# EAGLE design CDCEmu_Logic_v2.1 (EAGLE 9.6.2)
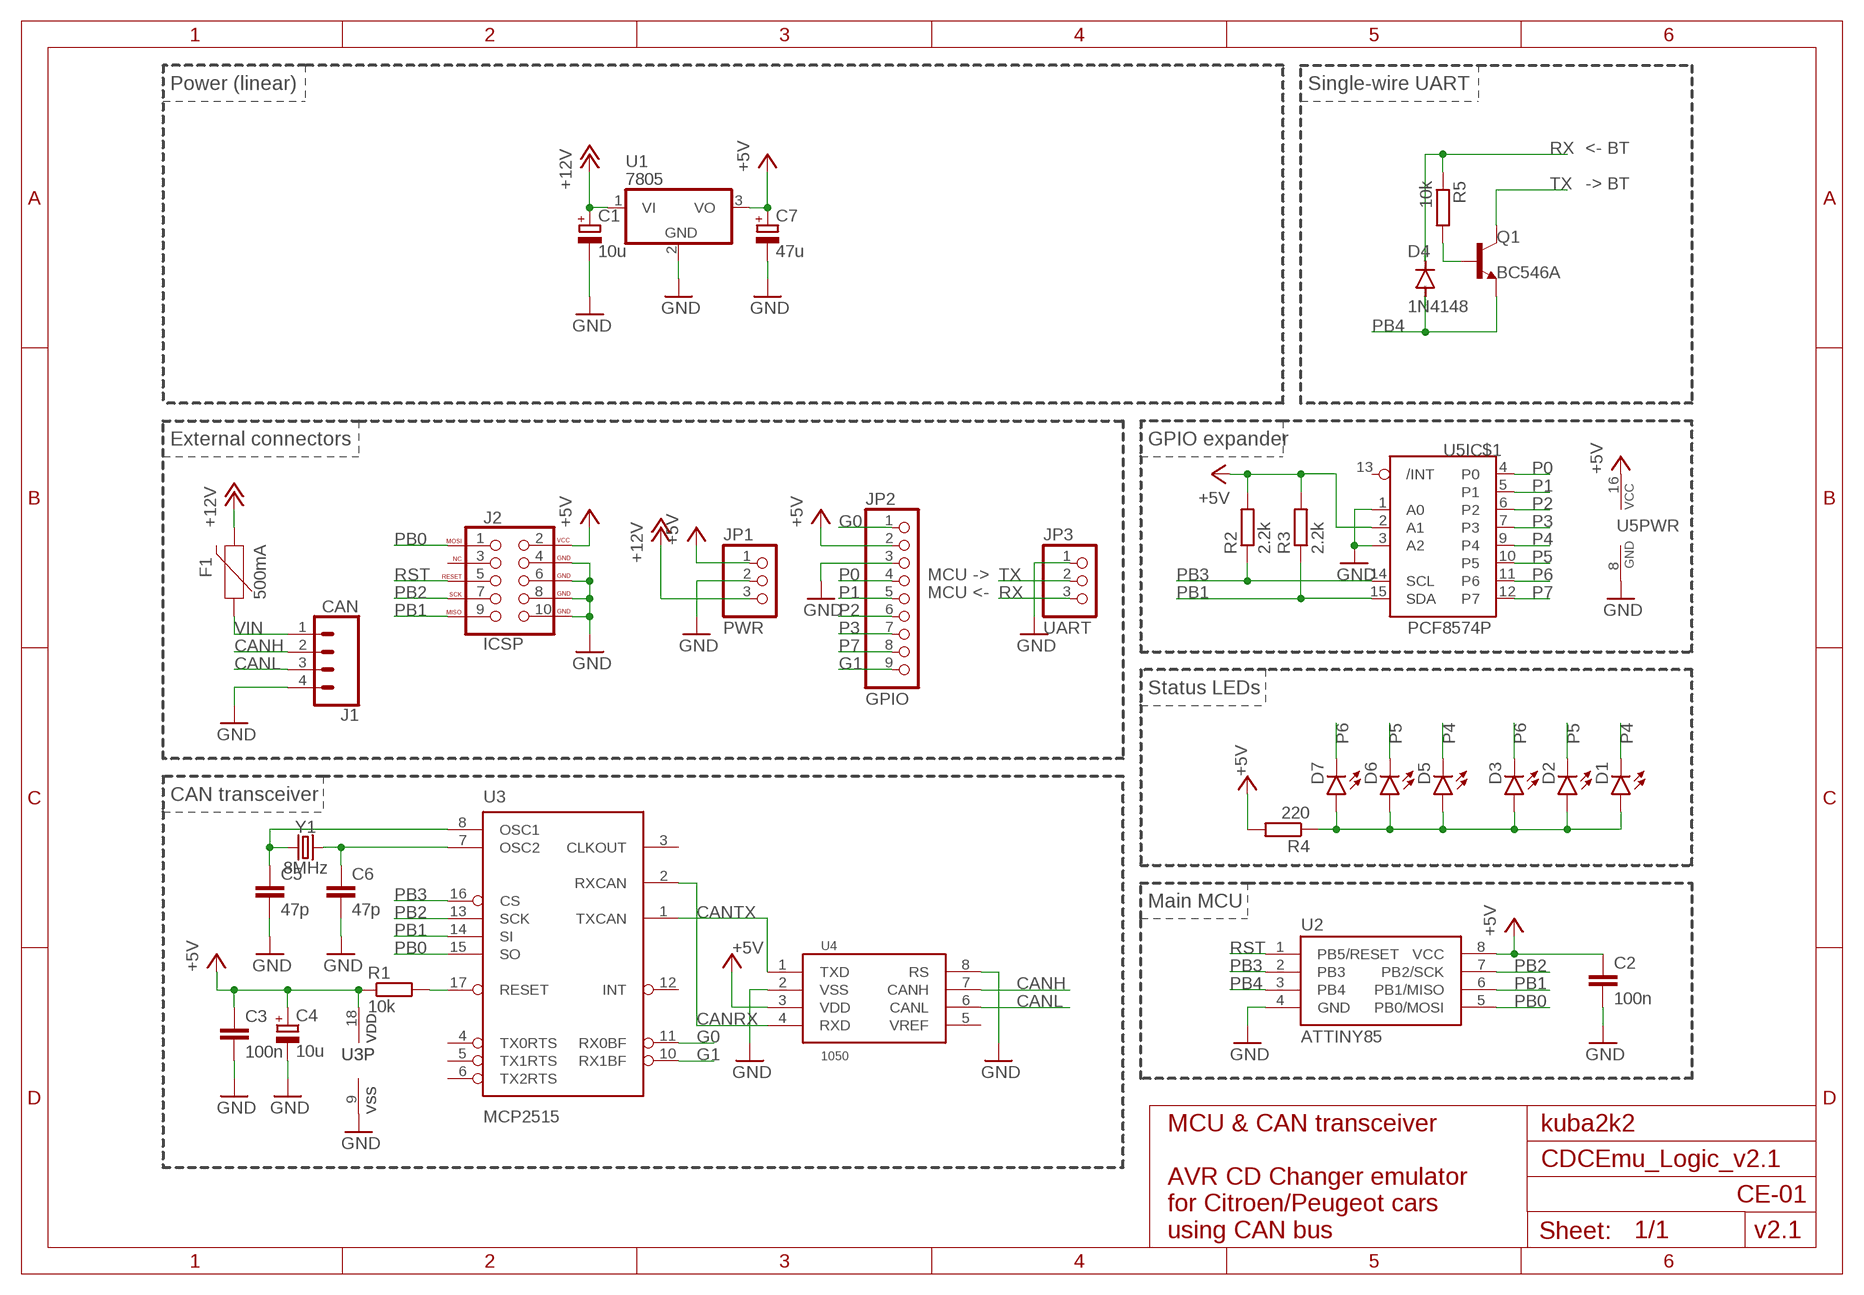
[diagram p0: schematic, sheet 1]

## Parts
C1  10u  CPOL-EUC2512  [C2512-POL]
C2  100n  C-EU050-024X044  [C050-024X044]
C3  100n  C-EU050-024X044  [C050-024X044]
C4  10u  CPOL-EUE2.5-6  [E2,5-6]
C5  47p  C-EUC0805  [C0805]
C6  47p  C-EUC0805  [C0805]
C7  47u  CPOL-EUC2512  [C2512-POL]
D1  LED3MM  [LED3MM]
D2  LED3MM  [LED3MM]
D3  LED3MM  [LED3MM]
D4  1N4148  1N4148DO35-7  [DO35-7]
D5  LEDCHIP-LED0805  [CHIP-LED0805]
D6  LEDCHIP-LED0805  [CHIP-LED0805]
D7  LEDCHIP-LED0805  [CHIP-LED0805]
F1  500mA  PPTC_16V_2.5A  [1812]
J1  CAN  CONN_04JST-PTH  [JST-4-PTH]
J2  ICSP  AVR_SPI_PROG_5X2LOCK  [2X5-SHROUDED_LOCK]
JP1  PWR  PINHD-1X3  [1X03]
JP2  GPIO  PINHD-1X9  [1X09]
JP3  UART  PINHD-1X3  [1X03]
Q1  BC546A  [TO92-EBC]
R1  10k  R-EU_R0805  [R0805]
R2  2.2k  R-EU_R0805  [R0805]
R3  2.2k  R-EU_R0805  [R0805]
R4  220  R-EU_0204/7  [0204/7]
R5  10k  R-EU_0204/7  [0204/7]
U1  7805  78T-NOHOLE  [TO220H-NOHOLE]
U2  ATTINY85  ATTINY85-P  [PDIP08_300MIL]
U3  MCP2515  MCP2515(MCP2510)SO  [SO18W]
U4  1050  TJA1050  [SO08]
U5  PCF8574P  [DIL16]
Y1  8MHz  CRYSTALPTH-HC49UV  [HC49U]

## Nets
+5V: C2.1 C3.1 C4.+ C7.+ J2.2(VCC) JP1.1 JP2.2 R1.1 R2.2 R3.2 R4.2 U1.3(VO) U2.8(VCC) U3.18(VDD) U4.3(VDD) U5.2(IC$1:A1) U5.16(PWR:VCC)
+12V: C1.+ F1.2 JP1.3 U1.1(VI)
CANH: J1.2 U4.7(CANH)
CANL: J1.3 U4.6(CANL)
CANOSC1: C5.1 U3.8(OSC1) Y1.1
CANOSC2: C6.1 U3.7(OSC2) Y1.2
CANRST: R1.2 U3.17(RESET)
CANRX: U3.2(RXCAN) U4.4(RXD)
CANTX: U3.1(TXCAN) U4.1(TXD)
G0: JP2.1 U3.11(RX0BF)
G1: JP2.9 U3.10(RX1BF)
GND: C1.- C2.2 C3.2 C4.- C5.2 C6.2 C7.- J1.4 J2.4(GND) J2.6(GND) J2.8(GND) J2.10(GND) JP1.2 JP2.3 JP3.1 U1.2(GND) U2.4(GND) U3.9(VSS) U4.2(VSS) U4.8(RS) U5.1(IC$1:A0) U5.3(IC$1:A2) U5.8(PWR:GND)
LED_A: D1.A D2.A D3.A D5.A D6.A D7.A R4.1
P0: JP2.4 U5.4(IC$1:P0)
P1: JP2.5 U5.5(IC$1:P1)
P2: JP2.6 U5.6(IC$1:P2)
P3: JP2.7 U5.7(IC$1:P3)
P4: D1.K(C) D5.C U5.9(IC$1:P4)
P5: D2.K(C) D6.C U5.10(IC$1:P5)
P6: D3.K(C) D7.C U5.11(IC$1:P6)
P7: JP2.8 U5.12(IC$1:P7)
PB0: J2.1(MOSI) U2.5(PB0/MOSI) U3.15(SO)
PB1: J2.9(MISO) R3.1 U2.6(PB1/MISO) U3.14(SI) U5.15(IC$1:SDA)
PB2: J2.7(SCK) U2.7(PB2/SCK) U3.13(SCK)
PB3: R2.1 U2.2(PB3) U3.16(CS) U5.14(IC$1:SCL)
PB4: D4.A Q1.E U2.3(PB4)
RST: J2.5(RESET) U2.1(PB5/RESET)
RX: D4.C JP3.3 R5.1
TX: JP3.2 Q1.C
TXB: Q1.B R5.2
VIN: F1.1 J1.1
Unconnected: J2.3(NC) U3.3(CLKOUT) U3.4(TX0RTS) U3.5(TX1RTS) U3.6(TX2RTS) U3.12(INT) U4.5(VREF) U5.13(IC$1:/INT)

## Notes on the sheet
- Power (linear) | Single-wire UART
- <- BT
- -> BT
- External connectors | GPIO expander
- MCU ->
- MCU <-
- Status LEDs
- CAN transceiver
- Main MCU
- MCU & CAN transceiver | kuba2k2
- CE-01
- AVR CD Changer emulator
  for Citroen/Peugeot cars
  using CAN bus
- v2.1

## Library data of the parts
C1 C7 = custom:CPOL-EU
C2 C3 C5 C6 = rcl:C-EU: CAPACITOR, European symbol; SPICEPREFIX: C
C4 = rcl:CPOL-EU: POLARIZED CAPACITOR, European symbol; SPICEPREFIX: C
D1-D3 D5-D7 = led:LED: LED OSRAM: - CHIPLED LG R971, LG N971, LY N971, LG Q971, LY Q971, LO R971, LY R971 LH N974, LH R974 LS Q976, LO Q976, LY Q976 LO Q996 - Hyper CHIPLED LW Q18S LB Q993, LB Q99A, LB R99A - SideLED LS A670, LO A670, LY A670, LG A670, LP A670 LB A673, LV A673, LT A673, LW A673 LH A674 LY A675 LS A676, LA A676, LO A676, LY A676, LW A676 LS A679, LY A679, LG A679 - Hyper Micro SIDELED® LS Y876, LA Y876, LO Y876, LY Y876 LT Y87S - SmartLED LW L88C, LW L88S LB L89C, LB L89S, LG L890 LS L89K, LO L89K, LY L89K LS L896, LA L896, LO L896, LY L896 - TOPLED LS T670, LO T670, LY T670, LG T670, LP T670 LSG T670, LSP T670, LSY T670, LOP T670, LYG T670 LG T671, LOG T671, LSG T671 LB T673, LV T673, LT T673, LW T673 LH T674 LS T676, LA T676, LO T676, LY T676, LB T676, LH T676, LSB T676, LW T676 LB T67C, LV T67C, LT T67C, LS T67K, LO T67K, LY T67K, LW E67C LS E67B, LA E67B, LO E67B, LY E67B, LB E67C, LV E67C, LT E67C LW T67C LS T679, LY T679, LG T679 LS T770, LO T770, LY T770, LG T770, LP T770 LB T773, LV T773, LT T773, LW T773 LH T774 LS E675, LA E675, LY E675, LS T675 LS T776, LA T776, LO T776, LY T776, LB T776 LHGB T686 LT T68C, LB T68C - Hyper Mini TOPLED® LB M676 - Mini TOPLED Santana® LG M470 LS M47K, LO M47K, LY M47K Source: http://www.osram.convergy.de LUXEON: - LUMILED® LXK2-PW12-R00, LXK2-PW12-S00, LXK2-PW14-U00, LXK2-PW14-V00 LXK2-PM12-R00, LXK2-PM12-S00, LXK2-PM14-U00 LXK2-PE12-Q00, LXK2-PE12-R00, LXK2-PE12-S00, LXK2-PE14-T00, LXK2-PE14-U00 LXK2-PB12-K00, LXK2-PB12-L00, LXK2-PB12-M00, LXK2-PB14-N00, LXK2-PB14-P00, LXK2-PB14-Q00 LXK2-PR12-L00, LXK2-PR12-M00, LXK2-PR14-Q00, LXK2-PR14-R00 LXK2-PD12-Q00, LXK2-PD12-R00, LXK2-PD12-S00 LXK2-PH12-R00, LXK2-PH12-S00 LXK2-PL12-P00, LXK2-PL12-Q00, LXK2-PL12-R00 Source: www.luxeon.com KINGBRIGHT: KA-3528ASYC Source: www.kingbright.com
D4 = diode:1N4148: DIODE high speed (Philips)
F1 = SparkFun-Fuses:PPTC: Resettable Fuse PPTC Resettable Fuse. Really a sort of resistor with a polymeric positive temperature coefficient whose resistance increases dramatically with an increase in temperature. When heated by the power passing through the resistance rises causing the current to be limited, protecting the circuit. This is achieved by the transition of the polymer from a crystalline to an amorphous state where the conductive carbon separates breaking the conductive pathways found in the cool crystalline structure. When a PPTC cools back down it resumes conducting letting the circuit turn back on. SparkFun Products: SparkFun RedBoard - Programmed with Arduino <https://www.sparkfun.com/products/12757> Pro Micro - 5V/16MHz <https://www.sparkfun.com/products/12640> Arduino Pro 328 - 5V/16MHz <https://www.sparkfun.com/products/10915> MP3 Trigger <https://www.sparkfun.com/products/13720>; PROD_ID: RES-14390; VALUE: 16V/2.5A(5A TRIP)
J1 = SparkFun-Connectors:CONN_04: Multi connection point. Often used as Generic Header-pin footprint for 0.1 inch spaced/style header connections On any of the 0.1 inch spaced packages, you can populate with these: Break Away Headers - Straight <https://www.sparkfun.com/products/116> (PRT-00116) Break Away Male Headers - Right Angle <https://www.sparkfun.com/products/553> (PRT-00553) Female Headers <https://www.sparkfun.com/products/115> (PRT-00115) Break Away Headers - Machine Pin <https://www.sparkfun.com/products/117> (PRT-00117) Break Away Female Headers - Swiss Machine Pin <https://www.sparkfun.com/products/743> (PRT-00743) For SCREWTERMINALS and SPRING TERMINALS visit here: Screw Terimnals on SparkFun.com <https://www.sparkfun.com/search/results?term=Screw+Terminals> (5mm/3.5mm/2.54mm spacing) This device is also useful as a general connection point to wire up your design to another part of your project. Our various solder wires solder well into these plated through hole pads. Hook-Up Wire - Assortment (Stranded, 22 AWG) <https://www.sparkfun.com/products/11375> (PRT-11375) Hook-Up Wire - Assortment (Solid Core, 22 AWG) <https://www.sparkfun.com/products/11367> (PRT-11367) View the entire wire category on our website here <https://www.sparkfun.com/categories/141> Special notes: Molex polarized connector foot print use with SKU : PRT-08231 with associated crimp pins and housings. 1MM SMD Version SKU: PRT-10208; PROD_ID: WIRE-13531; SF_ID: PRT-09916
J2 = SparkFun-Connectors:AVR_SPI_PROG_5X2: AVR 10-pin ICSP Header This is the standard AVR In Circuit Serial Programming header. Minimal, but includes pin one indicator. Works with standard Olimex programmers. SparkFun Products: 2x5 AVR ICSP Male Header <https://www.sparkfun.com/products/778> - PTH 2x5 Pin Shrouded Header <https://www.sparkfun.com/products/8506> - PTH2; PROD_ID: CONN-08671; SF_ID: PRT-08506
JP1 JP3 = pinhead:PINHD-1X3: PIN HEADER
JP2 = pinhead:PINHD-1X9: PIN HEADER
Q1 = transistor-npn:BC546*: NPN Transistor
R1-R5 = rcl:R-EU_: RESISTOR, European symbol; SPICEPREFIX: R
U1 = custom:78*: Positive VOLTAGE REGULATOR Source: http://cache.national.com/ds/LM/LM78L05.pdf http://www.fairchildsemi.com/ds/LM/LM7805.pdf
U2 = attinyx5:ATTINY85*: ATMEL ATtiny 85 Packages: P = PDIP 08 30mil S = SOIC 08 EIAJ 208mil Technologies Note: for complete ordering code (temp. range, finish, tape&reel etc.) see www.atmel.com • Supply Voltage: V = (1.8…5.5)V | [blank] = (2.7…5.5)V • Speed: 10 = 10 MHz | 20 = 20 MHz Author: Dipl.-Ing. FH Rainer Bayer HHN Hochschule Heilbronn (Heilbronn University), rainer.bayer@hs-heilbronn.de Ingenieurbüro ing-rb, mail@ing-rb.de
U3 = SparkFun-IC-Comms:MCP2515(MCP2510): CAN controller with SPI interface The MCP2515 controller supercedes the MCP2510 while addressing all errata associated with it. The two devices are pin compatible, either can be used with this device. 18-pin package SOIC Simple SPI interface to any MCU. One-shot mode ensures message transmission is attempted only once Databyte filtering Start-of-Frame (SOF) output Low-power CMOS Technology Datasheet <http://www.sparkfun.com/datasheets/DevTools/Arduino/MCP2515.pdf> SparkFun Products CAN-BUS Shield <https://www.sparkfun.com/products/13262> (DEV-13262); PROD_ID: IC-09906
U4 = can_driver:TJA1050: High speed CAN transceiver Input levels compatible with 3.3 V and 5 V devices 5V supply
U5 = i2c:PCF8574: Remote 8-Bit I/O Expander for I²C Bus
Y1 = SparkFun-Clocks:CRYSTAL: Crystals (Generic) These are passive quartz crystals, which can be used as a clock source for a microcontroller. Crystal's are two-terminal devices. They require external "load" capacitors to generate an oscillating signal.

## Board
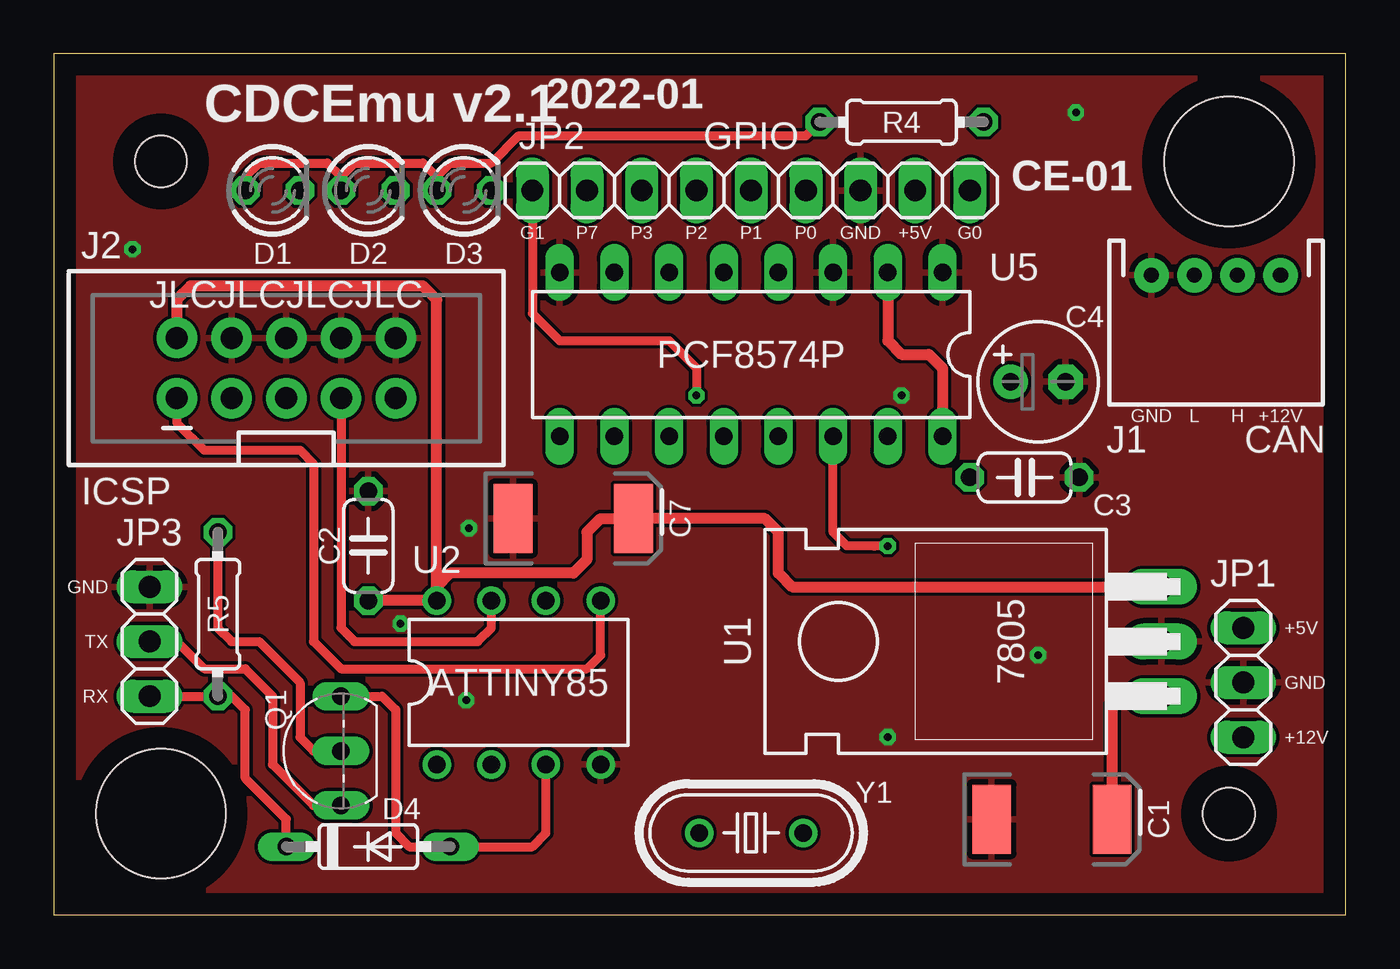
[diagram p1: board, top side]
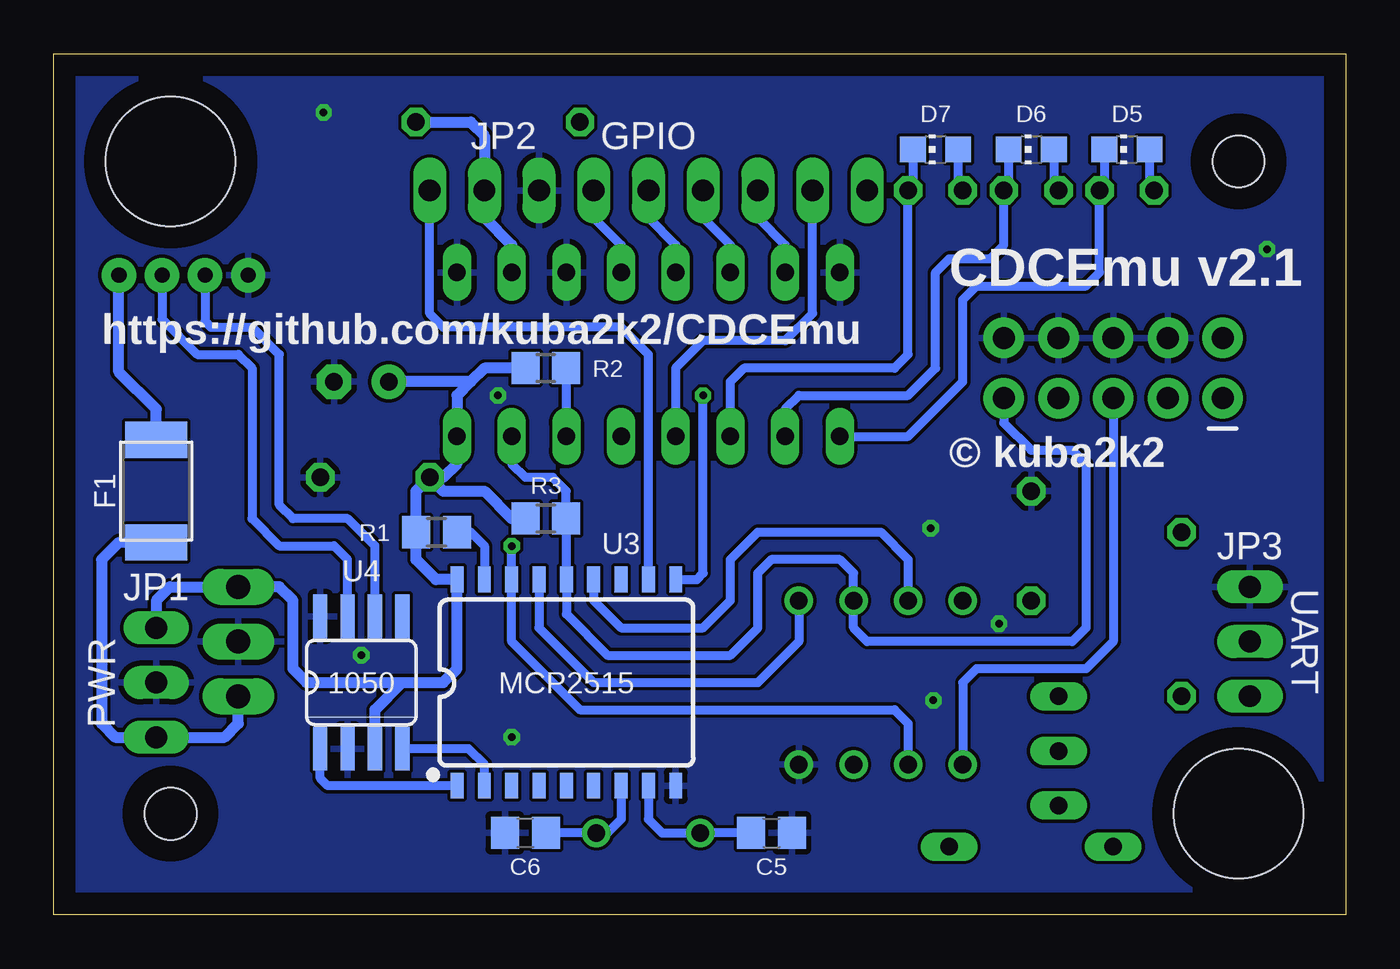
[diagram p2: board, bottom side, seen from below]

Size 60 x 40 mm. Coordinates in mm from the lower left corner, seen from the top.
Outline: 0,0 60,0 60,40 0,40 0,0
Copper layers (1*16): Top 0.035mm / dielectric 1.5mm / Bottom 0.035mm
Design rules "default *": minimum track width 6mil, minimum drill 0.35mm, track to track 6mil, track to pad 6mil, pad to pad 6mil, via to via 6mil, smd to smd 6mil, copper to edge 40mil, drill to drill 6mil, minimum pad ring 10mil, minimum via ring 8mil, stop-mask expansion 4mil, vias tented up to drill 16mil, thermal gap 10mil
Holes 6 mm at 4.97,4.7 54.58,35
Holes 2.4 mm at 4.97,35 54.58,4.7

### Footprints (pad centres in the part's own frame; a part is rotated, then mirrored left to right if it is on the bottom)
C2512-POL = smd 1.8 x 3.2: + -2.8,0; - 2.8,0
C050-024X044 = drill 0.813 octagon: 1 -2.54,0; 2 2.54,0
E2,5-6 = drill 0.813 pad 1.6: + -1.27,0 | drill 0.813 pad 1.6 octagon: - 1.27,0
C0805 = smd 1.3 x 1.5: 1 -0.95,0; 2 0.95,0
LED3MM = drill 0.813 octagon: A -1.27,0; K 1.27,0
DO35-7 = drill 0.813 long: A 3.81,0; C -3.81,0
CHIP-LED0805 = smd 1.2 x 1.2: A 0,-1.05; C 0,1.05
1812 = smd 1.676 x 2.896: 1 -2.388,0; 2 2.388,0
JST-4-PTH = drill 0.7 pad 1.6: 1 -3,0; 2 -1,0; 3 1,0; 4 3,0
2X5-SHROUDED_LOCK = drill 1.016 pad 1.88: 1 -1.397,5.08; 2 1.397,5.08; 3 -1.397,2.54; 4 1.397,2.54; 5 -1.397,0; 6 1.397,0; 7 -1.397,-2.54; 8 1.397,-2.54; 9 -1.397,-5.08; 10 1.397,-5.08
1X03 = drill 1.016 long: 1 -2.54,0; 2 0,0; 3 2.54,0
1X09 = drill 1.016 long: 1 -10.16,0; 2 -7.62,0; 3 -5.08,0; 4 -2.54,0; 5 0,0; 6 2.54,0; 7 5.08,0; 8 7.62,0; 9 10.16,0
TO92-EBC = drill 0.813 long: B 0,-1.27; C -2.54,-1.27; E 2.54,-1.27
R0805 = smd 1.3 x 1.5: 1 -0.95,0; 2 0.95,0
0204/7 = drill 0.813 octagon: 1 -3.81,0; 2 3.81,0
TO220H-NOHOLE = drill 1.118 long: 1 -2.54,-10.16; 2 0,-10.16; 3 2.54,-10.16
PDIP08_300MIL = drill 0.813: 1 -3.81,-3.81; 2 -1.27,-3.81; 3 1.27,-3.81; 4 3.81,-3.81; 5 3.81,3.81; 6 1.27,3.81; 7 -1.27,3.81; 8 -3.81,3.81
SO18W = smd 0.6 x 1.2: 1 -5.08,-4.788; 2 -3.81,-4.788; 3 -2.54,-4.788; 4 -1.27,-4.788; 5 0,-4.788; 6 1.27,-4.788; 7 2.54,-4.788; 8 3.81,-4.788; 9 5.08,-4.788; 10 5.08,4.788; 11 3.81,4.788; 12 2.54,4.788; 13 1.27,4.788; 14 0,4.788; 15 -1.27,4.788; 16 -2.54,4.788; 17 -3.81,4.788; 18 -5.08,4.788
SO08 = smd 0.66 x 2.032: 1 -1.905,-3.073; 2 -0.635,-3.073; 3 0.635,-3.073; 4 1.905,-3.073; 5 1.905,3.073; 6 0.635,3.073; 7 -0.635,3.073; 8 -1.905,3.073
DIL16 = drill 0.813 long: 1 -8.89,-3.81; 2 -6.35,-3.81; 3 -3.81,-3.81; 4 -1.27,-3.81; 5 1.27,-3.81; 6 3.81,-3.81; 7 6.35,-3.81; 8 8.89,-3.81; 9 8.89,3.81; 10 6.35,3.81; 11 3.81,3.81; 12 1.27,3.81; 13 -1.27,3.81; 14 -3.81,3.81; 15 -6.35,3.81; 16 -8.89,3.81
HC49U = drill 0.813: 1 -2.413,0; 2 2.413,0

### Placement (x,y rotation side)
C1  46.35,4.45 180 top
C2  14.61,17.14 90 top
C3  45.09,20.32 0 top
C4  45.72,24.77 0 top
C5  26.67,3.81 0 bottom
C6  38.1,3.81 180 bottom
C7  24.13,18.41 180 top
D1  10.16,33.66 0 top
D2  14.61,33.66 0 top
D3  19.05,33.66 0 top
D4  14.61,3.17 0 top
D5  10.16,35.56 90 bottom
D6  14.61,35.56 90 bottom
D7  19.05,35.56 90 bottom
F1  55.24,19.68 270 bottom
J1  53.98,29.72 180 top
J2  10.79,25.4 90 top
JP1  55.24,10.79 270 top
JP2  32.38,33.66 180 top
JP3  4.45,12.7 270 top
Q1  12.06,7.62 90 top
R1  42.23,17.78 0 bottom
R2  37.15,25.4 180 bottom
R3  37.15,18.41 180 bottom
R4  39.37,36.83 0 top
R5  7.62,13.97 90 top
U1  41.27,12.7 90 top
U2  21.59,10.79 0 top
U3  36.2,10.79 0 bottom
U4  45.72,10.79 0 bottom
U5  32.38,26.04 180 top
Y1  32.38,3.81 0 top

### Tracks (layer width: path | path; a pad name or v marks a point on that pad's centre or on a via)
+5V
  Top 0.508: 17.78,15.24 18.41,15.88 24.13,15.88 24.77,16.51 24.77,17.78 25.4,18.41 C7.+ 33.02,18.41 33.66,17.78 33.66,15.88 34.29,15.24 U1.3 | C2.1 U2.8 17.78,15.24 | 17.78,15.24 17.78,28.57 17.14,29.21 6.35,29.21 5.71,28.57 J2.2 | U5.2 38.73,26.67 39.37,26.04 40.64,26.04 41.27,25.4 U5.16
  Bottom 0.508: 43.81,10.79 48.26,10.79 48.9,11.43 48.9,14.61 49.53,15.24 U1.3 54.61,15.24 55.24,14.61 JP1.1 | U4.3 45.09,9.53 43.81,10.79 | 43.81,10.79 41.91,10.79 41.27,11.43 U3.18 | U3.18 41.27,15.88 | R1.1 43.18,16.51 42.25,15.58 U3.18 | R2.2 40.01,25.4 40.64,24.77 | 40.64,24.77 41.27,24.13 U5.16 41.27,20.95 41.91,20.32 C3.1 | R3.2 38.73,18.41 40.01,19.68 41.91,19.68 C3.1 | R1.1 43.17,18.42 | 40.64,24.77 C4.+ | R1.1 43.17,19.68 43.18,19.68 C3.1 | U5.2 38.73,31.11 40.01,32.38 JP2.2 40.01,36.2 40.64,36.83 R4.2
+12V
  Top 0.508: C1.+ 49.16,9.79 49.53,10.16 U1.1
  Bottom 0.508: F1.2 57,17.3 57.78,16.51 57.78,8.89 57.15,8.26 JP1.3 52.07,8.26 51.44,8.89 U1.1
CANH
  Bottom 0.406: U4.7 46.35,16.51 46.99,17.14 49.53,17.14 50.8,18.41 50.8,25.4 51.44,26.04 53.34,26.04 54.98,27.67 J1.2
CANL
  Bottom 0.406: U4.6 45.09,17.14 46.35,18.41 48.9,18.41 49.53,19.05 49.53,26.04 50.8,27.3 52.7,27.3 52.98,27.57 J1.3
CANOSC1
  Bottom 0.406: C5.1 Y1.1 31.75,3.81 32.38,4.45 U3.8
CANOSC2
  Bottom 0.406: U3.7 33.66,4.45 34.29,3.81 Y1.2 C6.1
CANRST
  Bottom 0.406: U3.17 40.01,17.14 40.64,17.78 R1.2
CANRX
  Bottom 0.406: U3.2 40.01,6.99 40.74,7.72 U4.4
CANTX
  Bottom 0.406: U3.1 47.28,6.01 47.62,6.35 U4.1
G0
  Bottom 0.406: JP2.1 42.55,27.94 41.91,27.3 33.66,27.3 32.38,26.04 U3.11
G1  (via drill 0.35)
  Top 0.406: JP2.9 22.23,27.94 23.5,26.67 28.57,26.67 29.84,25.4 v29.84,24.13
  Bottom 0.406: U3.10 30.14,15.58 29.84,15.88 v29.84,24.13
GND  (via drill 0.35)
  other vias: 3.66,30.92 45.72,12.06 19.28,17.97 47.47,37.27 19.15,9.97 16.1,13.52 38.73,8.26 39.37,24.13
  pour Bottom: 0,40 0,0 60,0 60,40
  pour Top: 0,0 60,0 60,40 0,40
LED_A
  Top 0.406: D1.A 8.89,34.29 9.53,34.92 12.7,34.92 13.34,34.29 | D2.A 13.34,34.29 | 13.34,34.29 13.97,34.92 17.14,34.92 17.78,34.29 | R4.1 34.92,36.2 21.59,36.2 20.32,34.92 18.41,34.92 17.78,34.29 | D3.A 17.78,34.29
  Bottom 0.406: D5.A 9.11,33.88 D1.A | D6.A 13.55,33.88 D2.A | D7.A 18,33.88 D3.A
P0
  Bottom 0.406: U5.4 33.66,31.11 34.92,32.38 JP2.4
P1
  Bottom 0.406: U5.5 31.11,31.11 32.38,32.38 JP2.5
P2
  Bottom 0.406: U5.6 28.57,31.11 29.84,32.38 JP2.6
P3
  Bottom 0.406: U5.7 26.04,31.11 27.3,32.38 JP2.7
P4
  Bottom 0.406: D5.C 11.21,33.88 D1.K 11.43,29.84 12.06,29.21 17.14,29.21 17.78,28.57 17.78,24.77 20.32,22.23 U5.9
P5
  Bottom 0.406: D6.C 15.65,33.88 D2.K 15.88,31.11 16.51,30.48 18.41,30.48 19.05,29.84 19.05,25.4 20.32,24.13 25.4,24.13 26.04,23.5 U5.10
P6
  Bottom 0.406: D7.C 20.1,33.88 D3.K 20.32,26.04 20.95,25.4 27.94,25.4 28.57,24.77 U5.11
P7
  Bottom 0.406: U5.12 31.11,25.4 29.84,26.67 26.04,26.67 24.77,27.94 JP2.8
PB0
  Top 0.406: J2.1 5.71,22.86 6.99,21.59 11.43,21.59 12.06,20.95 12.06,12.7 13.34,11.43 24.77,11.43 25.4,12.06 U2.5
  Bottom 0.406: U3.15 37.47,13.34 34.92,10.79 27.3,10.79 25.4,12.7 U2.5
PB1
  Bottom 0.406: J2.9 15.88,22.86 14.61,21.59 12.7,21.59 12.06,20.95 12.06,13.34 12.7,12.7 22.23,12.7 22.86,13.34 U2.6 22.86,15.88 23.5,16.51 26.67,16.51 27.3,15.88 27.3,13.34 28.57,12.06 34.29,12.06 36.2,13.97 U3.14 R3.1 36.2,19.69 36.83,20.32 38.1,20.32 38.73,20.95 U5.15
PB2
  Top 0.406: J2.7 13.34,13.34 13.97,12.7 19.68,12.7 20.32,13.34 U2.7
  Bottom 0.406: U3.13 34.92,14.61 33.66,13.34 29.84,13.34 28.57,14.61 28.57,16.51 27.3,17.78 21.59,17.78 20.32,16.51 U2.7
PB3  (via drill 0.35)
  Top 0.406: U5.14 36.2,17.78 36.83,17.14 38.1,17.14 38.11,17.13 v38.73,17.13
  Bottom 0.406: U2.2 20.32,8.89 20.95,9.53 35.56,9.53 38.73,12.7 U3.16 v38.73,17.13 | R2.1 U5.14
PB4
  Top 0.406: U2.3 22.86,3.81 22.23,3.17 D4.A 16.51,3.17 15.88,3.81 15.88,9.53 15.24,10.16 Q1.E
RST
  Bottom 0.406: J2.5 10.79,12.7 12.06,11.43 17.14,11.43 17.78,10.79 U2.1
RX
  Top 0.406: JP3.3 R5.1 8.26,10.16 8.89,9.53 8.89,6.35 10.79,4.45 D4.C
TX
  Top 0.406: JP3.2 5.71,12.7 6.99,11.43 8.89,11.43 10.16,10.16 10.16,6.99 12.06,5.08 Q1.C
TXB
  Top 0.406: Q1.B 12.06,7.62 11.43,8.26 11.43,10.79 9.53,12.7 8.26,12.7 7.62,13.34 R5.2
VIN
  Bottom 0.508: F1.1 55.24,23.5 56.98,25.23 J1.1

### Text on the board
tPlace: CDCEmu v2.1 | 2022-01 | CE-01 | G1 | P7 | P3 | P2 | P1 | P0 | GND | +5V | G0 | JLCJLCJLCJLC | GND | L | H | +12V | GND | TX | +5V | GND | RX | +12V
bPlace: CDCEmu v2.1 | https://github.com/kuba2k2/CDCEmu | © kuba2k2
bNames: GPIO | JP2 | JP3 | JP1 | UART